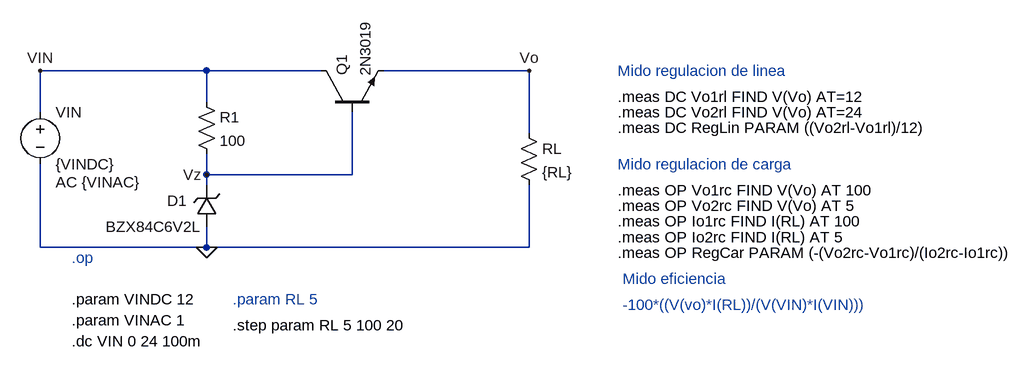
[diagram p0: schematic Regulador_lineal_version1.asc]
Regulador_lineal_version1.asc, the LTspice schematic file:
Version 4
SHEET 1 1432 680
WIRE 80 64 -176 64
WIRE 256 64 80 64
WIRE 576 64 352 64
WIRE 80 112 80 64
WIRE -176 128 -176 64
WIRE 576 160 576 64
WIRE 80 224 80 192
WIRE 304 224 304 128
WIRE 304 224 80 224
WIRE 80 240 80 224
WIRE -176 336 -176 208
WIRE 80 336 80 304
WIRE 80 336 -176 336
WIRE 576 336 576 240
WIRE 576 336 80 336
FLAG 80 336 0
FLAG -176 64 VIN
FLAG 576 64 Vo
FLAG 80 224 Vz
DATAFLAG 448 64 ""
SYMBOL res 64 96 R0
SYMATTR InstName R1
SYMATTR Value 100
SYMBOL zener 96 304 R180
WINDOW 0 46 40 Left 2
WINDOW 3 24 0 Left 2
SYMATTR InstName D1
SYMATTR Value BZX84C6V2L
SYMBOL voltage -176 112 R0
WINDOW 123 24 124 Left 2
WINDOW 39 0 0 Left 0
SYMATTR Value2 AC {VINAC}
SYMATTR InstName VIN
SYMATTR Value {VINDC}
SYMBOL res 560 144 R0
SYMATTR InstName RL
SYMATTR Value {RL}
SYMBOL npn 256 128 R270
SYMATTR InstName Q1
SYMATTR Value 2N3019
TEXT -128 352 Left 2 ;.op
TEXT -128 480 Left 2 !.dc VIN 0 24 100m
TEXT -128 416 Left 2 !.param VINDC 12
TEXT -128 448 Left 2 !.param VINAC 1
TEXT 120 416 Left 2 ;.param RL 5
TEXT 120 456 Left 2 !.step param RL 5 100 20
TEXT 712 64 Left 2 ;Mido regulacion de linea
TEXT 712 104 Left 2 !.meas DC Vo1rl FIND V(Vo) AT=12
TEXT 712 128 Left 2 !.meas DC Vo2rl FIND V(Vo) AT=24
TEXT 712 152 Left 2 !.meas DC RegLin PARAM ((Vo2rl-Vo1rl)/12)
TEXT 712 208 Left 2 ;Mido regulacion de carga
TEXT 712 248 Left 2 !.meas OP Vo1rc FIND V(Vo) AT 100
TEXT 712 272 Left 2 !.meas OP Vo2rc FIND V(Vo) AT 5
TEXT 712 344 Left 2 !.meas OP RegCar PARAM (-(Vo2rc-Vo1rc)/(Io2rc-Io1rc))
TEXT 712 296 Left 2 !.meas OP Io1rc FIND I(RL) AT 100
TEXT 712 320 Left 2 !.meas OP Io2rc FIND I(RL) AT 5
TEXT 720 384 Left 2 ;Mido eficiencia
TEXT 720 424 Left 2 ;-100*((V(vo)*I(RL))/(V(VIN)*I(VIN)))

The netlist it stands for:
* Regulador_lineal_version1.asc
R1 VIN Vz 100
D1 0 Vz BZX84C6V2L
VIN VIN 0 {VINDC} AC {VINAC}
RL Vo 0 {RL}
Q1 VIN Vz Vo 0 2N3019
.model D D
.lib standard.dio
.model NPN NPN
.model PNP PNP
.lib standard.bjt
* .op
.dc VIN 0 24 100m
.param VINDC 12
.param VINAC 1
* .param RL 5
.step param RL 5 100 20
* Mido regulacion de linea
.meas DC Vo1rl FIND V(Vo) AT=12
.meas DC Vo2rl FIND V(Vo) AT=24
.meas DC RegLin PARAM ((Vo2rl-Vo1rl)/12)
* Mido regulacion de carga
.meas OP Vo1rc FIND V(Vo) AT 100
.meas OP Vo2rc FIND V(Vo) AT 5
.meas OP RegCar PARAM (-(Vo2rc-Vo1rc)/(Io2rc-Io1rc))
.meas OP Io1rc FIND I(RL) AT 100
.meas OP Io2rc FIND I(RL) AT 5
* Mido eficiencia
* -100*((V(vo)*I(RL))/(V(VIN)*I(VIN)))
.backanno
.end